# EasyEDA Pro project 2025智能物流搬运_PCB_XAUT_20250927.eprj, schematic Schematic15_1

## Sheets
1 P1: Board Name: 控制板_2.2; Create Date: 2025-07-05; Page Name: P1; Project Name: 物流车底盘测试; Schematic Name: Schematic15_1; Update Date: 2025-07-05; Company: 嘉立创EDA; Page Size: A4; Version: V1.0
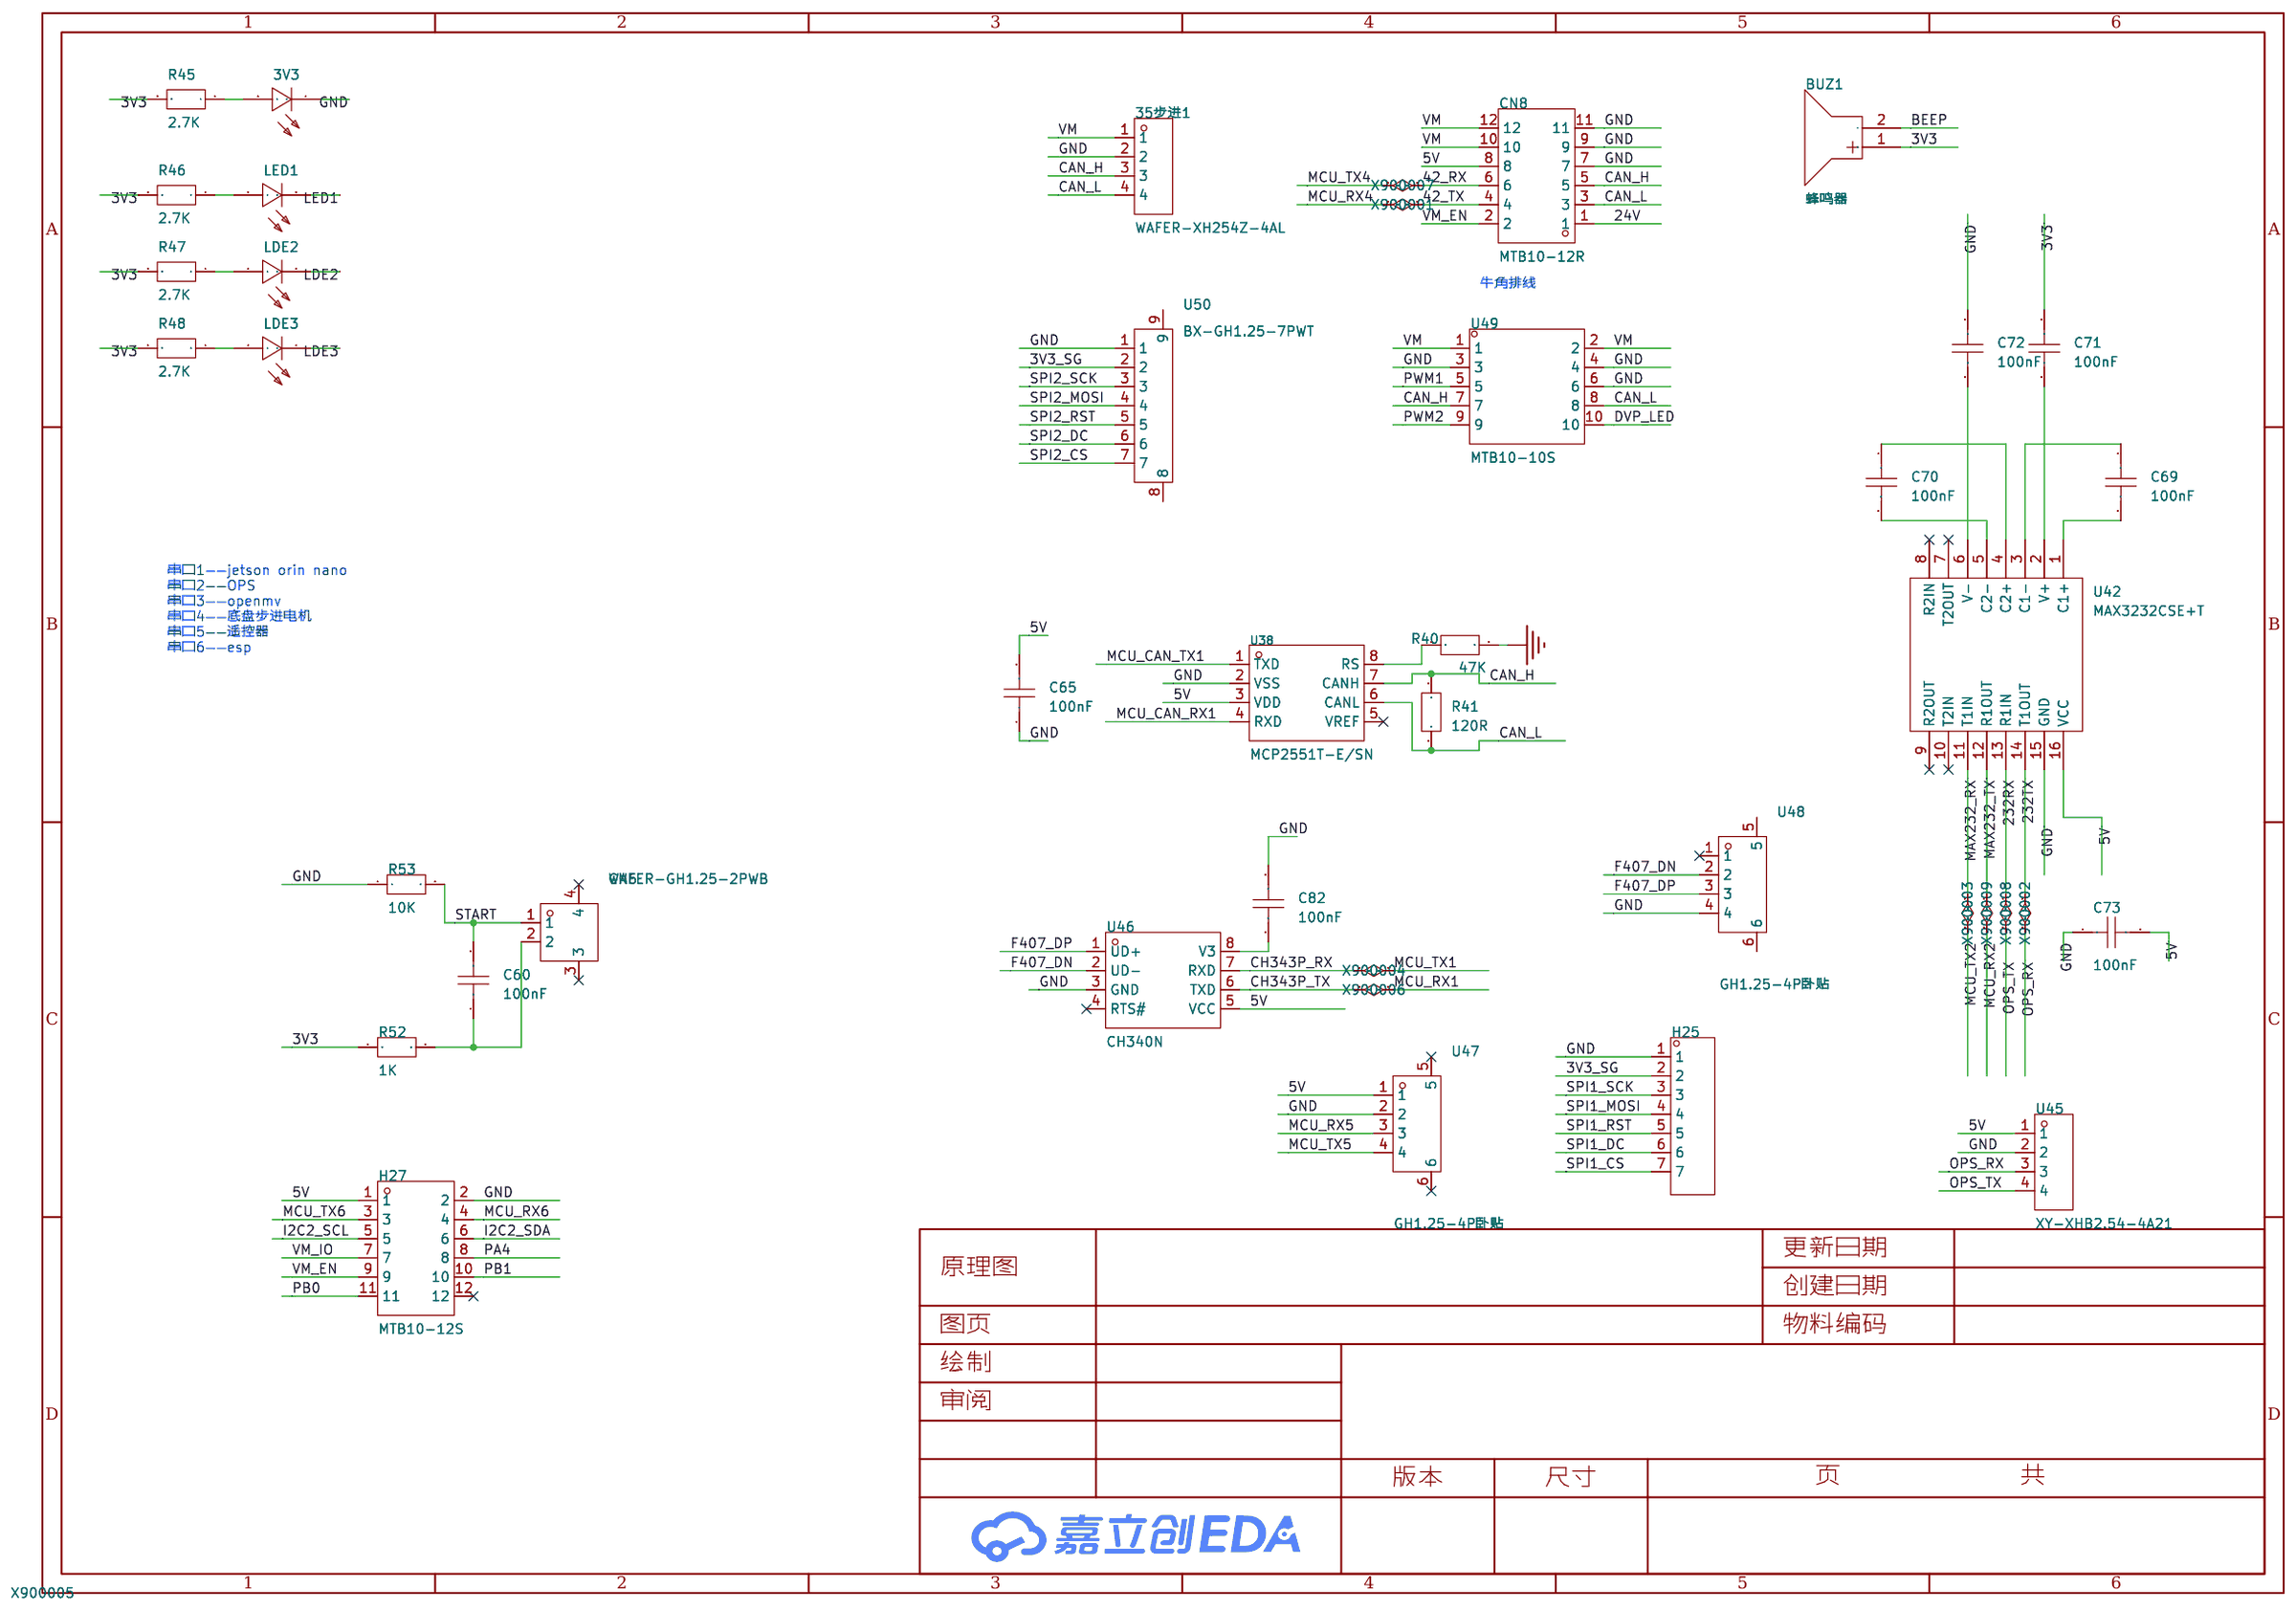
[diagram p3: P1]
2 P2: Page Name: P2
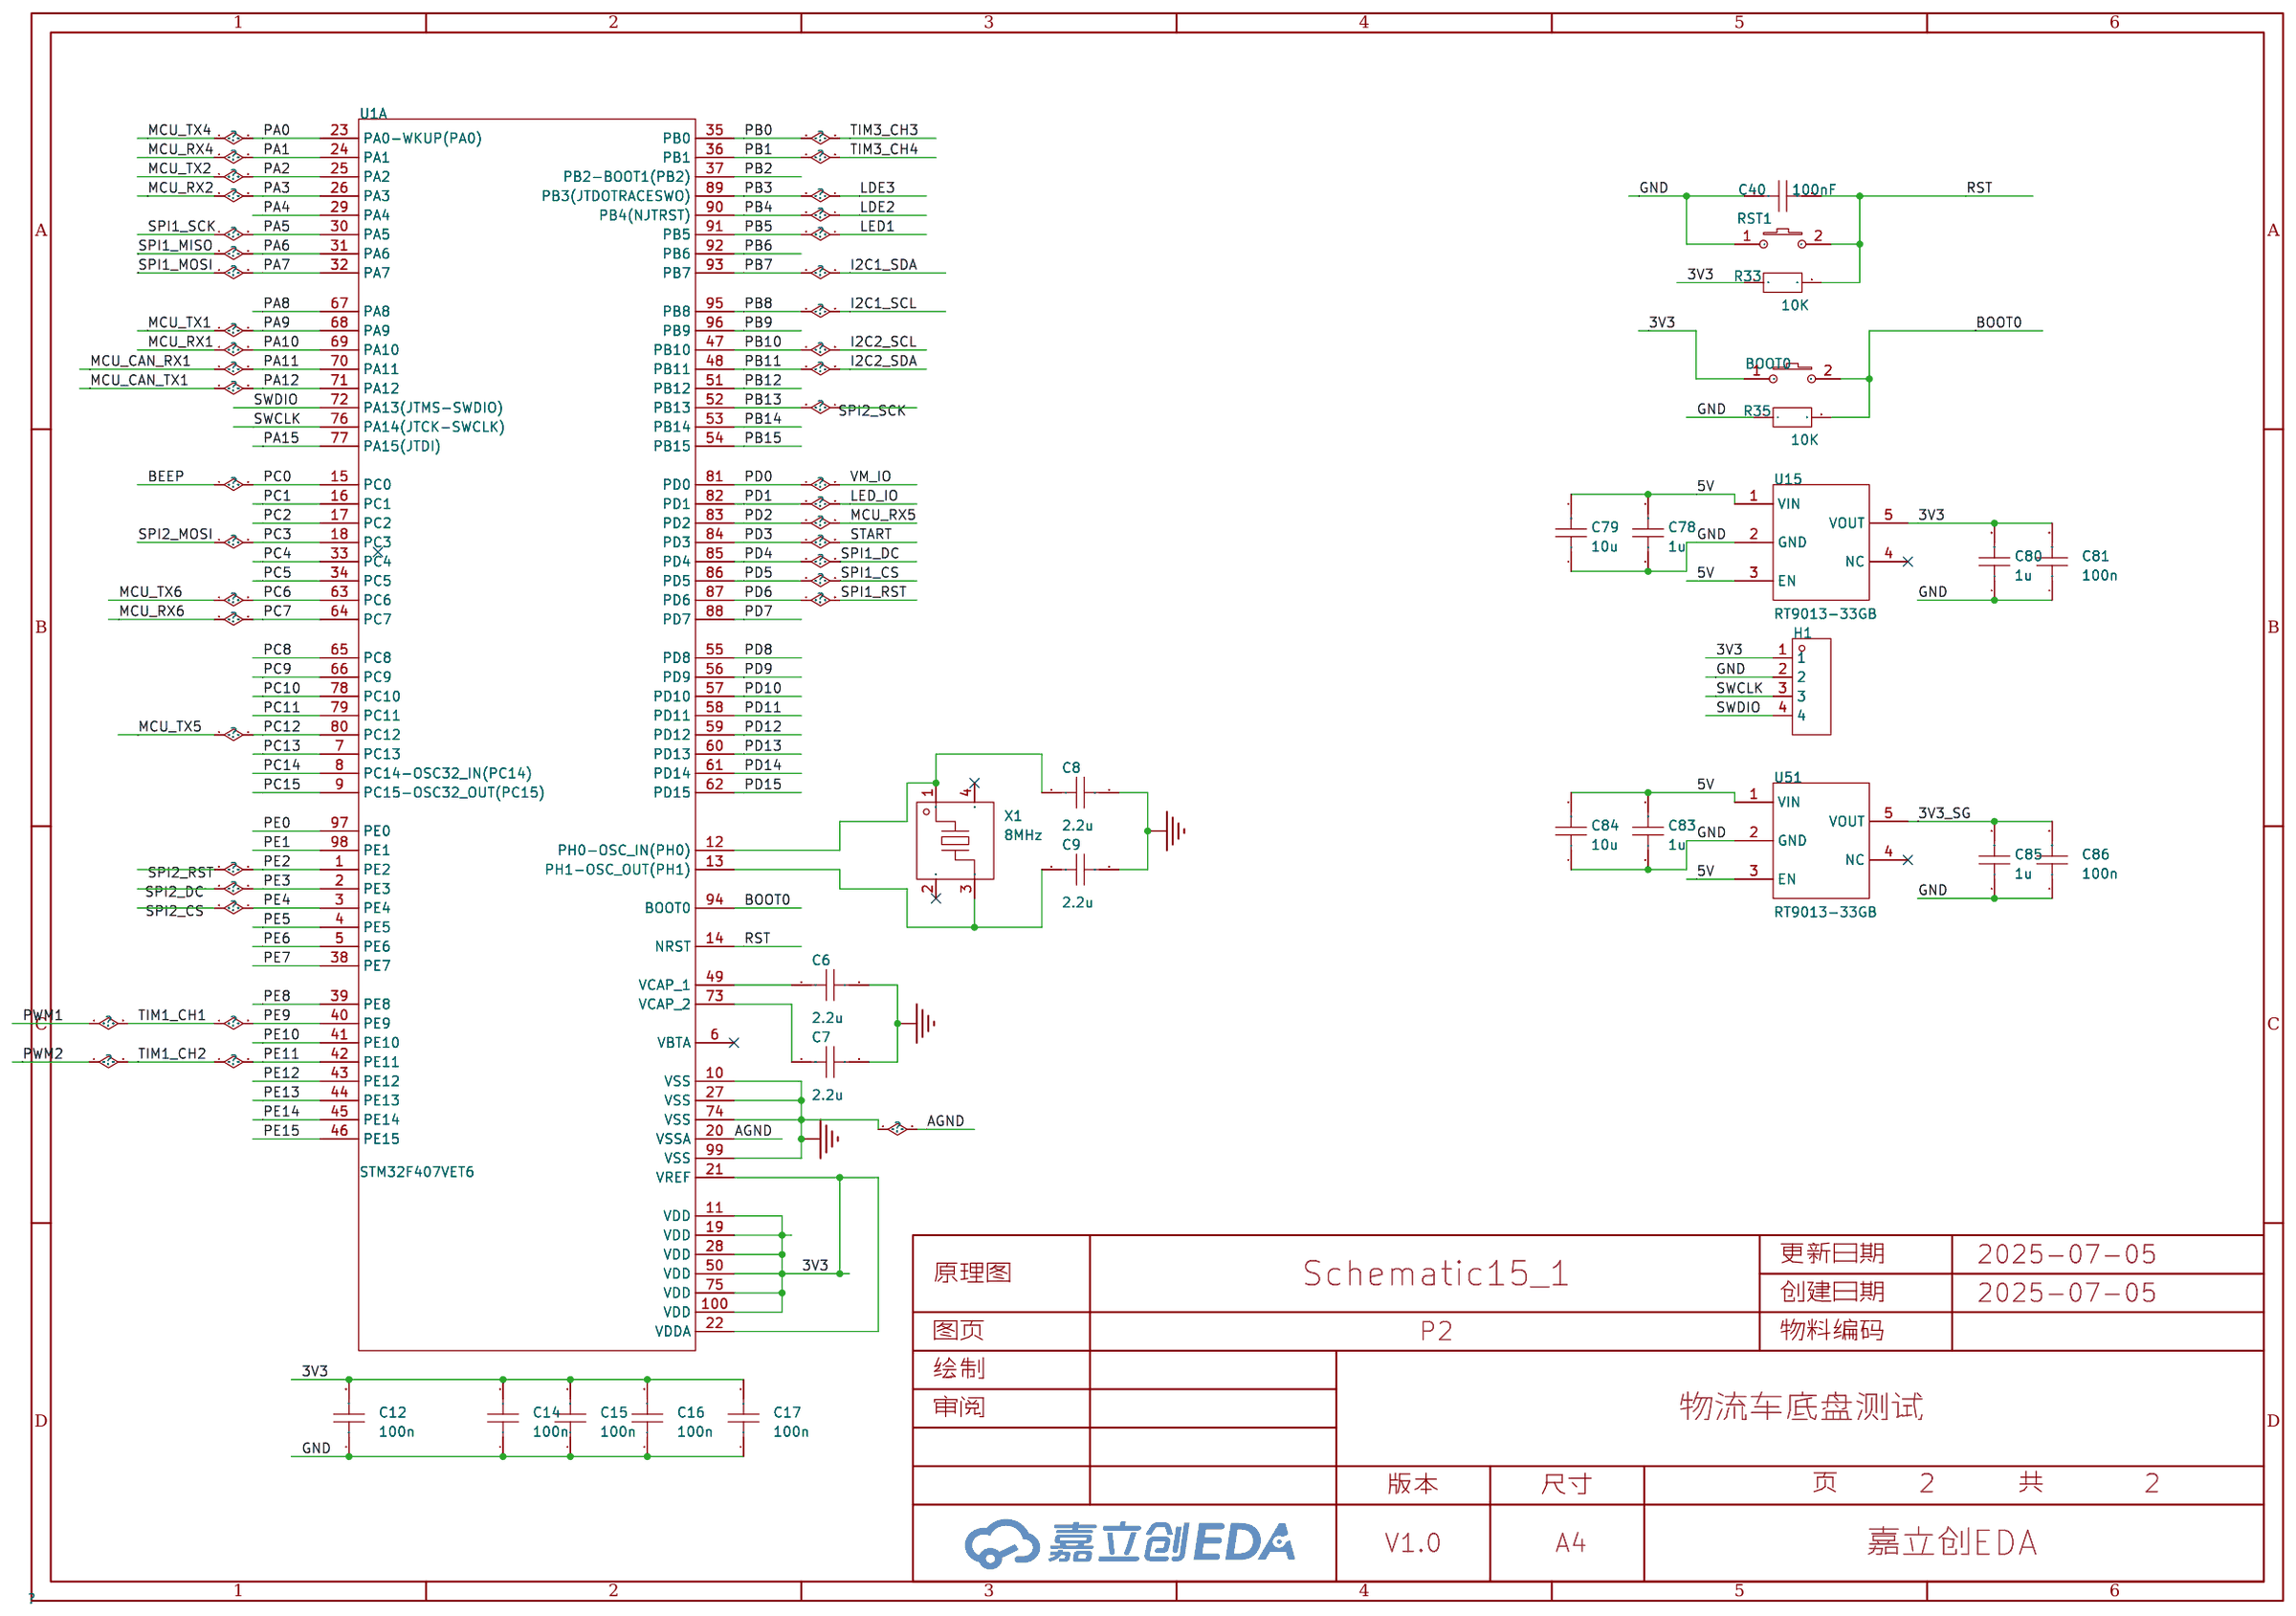
[diagram p4: P2]

## Parts
sheet P1
3V3  FC-DA1608HRK-620D  [LED0603-RD_RED]
35步进1  WAFER-XH254Z-4AL  [CONN-TH_XH2.54-4P]
BUZ1  蜂鸣器  [BUZ-TH_BD9.0-P5.00-D0.6-FD]
C60  100nF  [C0603]
C65  100nF  [C0603]
C69  100nF  [C0603]
C70  100nF  [C0603]
C71  100nF  [C0603]
C72  100nF  [C0603]
C73  100nF  [C0603]
C82  100nF  [C0603]
CN6  WAFER-GH1.25-2PWB  [CONN-TH_2P-P1.25_XUNPU_WAFER-GH1.25-2PWB]
CN8  MTB10-12R  [CONN-TH_MTB10-12R]
H25  -  [HDR-TH_7P-P2.54-V-F]
H27  MTB10-12S  [CONN-TH_12P-P2.54_MTB10-12S]
LDE2  FC-DA1608HRK-620D  [LED0603-RD_RED]
LDE3  FC-DA1608HRK-620D  [LED0603-RD_RED]
LED1  FC-DA1608HRK-620D  [LED0603-RD_RED]
R40  47K  [R0603]
R41  120R  [R0603]
R45  2.7K  [R0603]
R46  2.7K  [R0603]
R47  2.7K  [R0603]
R48  2.7K  [R0603]
R52  1K  [R0603]
R53  10K  [R0603]
U38  MCP2551T-E/SN  [SOIC-8_L4.9-W3.9-P1.27-LS6.0-BL]
U42  MAX3232CSE+T  [SOIC-16_L9.9-W3.9-P1.27-LS6.0-BL]
U45  XY-XHB2.54-4A21  [HDR-TH_4P-P2.50-H-F-W7.3-N]
U46  CH340N  [SOP-8_L4.9-W3.9-P1.27-LS6.0-BL]
U47  GH1.25-4P卧贴  [CONN-SMD_4P-P1.25_GH1.25-4P]
U48  GH1.25-4P卧贴  [CONN-SMD_4P-P1.25_GH1.25-4P]
U49  MTB10-10S  [IDC-TH_MTB110-10S]
U50  BX-GH1.25-7PWT  [CONN-SMD_7P-P1.25_BX-GH1.25-7PWT]
sheet P2
BOOT0  K2-3.6×6.1_SMD  [3*6*2.5MM轻触开关]
C6  2.2u  [C0603]
C7  2.2u  [C0603]
C8  2.2u  [C0603]
C9  2.2u  [C0603]
C12  100n  [C0603]
C14  100n  [C0603]
C15  100n  [C0603]
C16  100n  [C0603]
C17  100n  [C0603]
C40  100nF  [C0603]
C78  1u  [C0603]
C79  10u  [C0603]
C80  1u  [C0603]
C81  100n  [C0603]
C83  1u  [C0603]
C84  10u  [C0603]
C85  1u  [C0603]
C86  100n  [C0603]
H1  -  [HDR-TH_4P-P2.54-V-M]
R33  10K  [R0603]
R35  10K  [R0603]
RST1  K2-3.6×6.1_SMD  [3*6*2.5MM轻触开关]
U1  STM32F407VET6  [LQFP-100_L14.0-W14.0-P0.50-LS16.0-BL]  (section 1)
U15  RT9013-33GB  [SOT-23-5_L3.0-W1.7-P0.95-LS2.8-BL]
U51  RT9013-33GB  [SOT-23-5_L3.0-W1.7-P0.95-LS2.8-BL]
X1  8MHz  [CRYSTAL-SMD_4P-L3.2-W2.5-BL]

## Library data of the parts
3V3 LDE2 LDE3 LED1 = FC-DA1608HRK-620D: link: https://item.szlcsc.com/221679.html; Supplier: LCSC; Manufacturer: 国星光电; Manufacturer Part: NCD0603R1; Supplier Part: C84263; JLCPCB Part Class: Extended Part
35步进1 = WAFER-XH254Z-4AL: LCSC Part Name: XH直针4P 蓝色; Supplier Part: C22751797; Manufacturer: HANBO(汉博); Supplier Footprint: 插件,P=2.54mm; JLCPCB Part Class: 扩展库; Datasheet: https://atta.szlcsc.com/upload/public/pdf/source/20240628/5F265ED5DCD1AB9F6070F992FAF53820.pdf; Supplier: LCSC
BUZ1 = 蜂鸣器: Supplier Part: C9900020875; Supplier Footprint: 插件; JLCPCB Part Class: 扩展库; Supplier: LCSC
C40 C60 C65 C69-C73 C82 = 100nF: link: https://item.szlcsc.com/362304.html; 3DModel: C0603_L1.6-W0.8-H0.8
CN6 = WAFER-GH1.25-2PWB: LCSC Part Name: 1x2P 间距:1.25mm 卧贴 系列:GH; Supplier Part: C3029377; Manufacturer: XUNPU(讯普); Supplier Footprint: SMD,P=1.25mm,卧贴; Datasheet: https://atta.szlcsc.com/upload/public/pdf/source/20220527/CB8773BFB0913C3B8ABD62CB38BA101A.pdf; Supplier: LCSC; Pins Structure: 1x2P; Pitch: 1.25mm; Mounting Style: 卧贴; Reference Series: GH; Number of Pins: 2P; Number of Rows: 1; Number of PINs Per Row: 2; Current Rating (Max): 1A; Operating Temperature Range: -25℃~+85℃
CN8 = MTB10-12R: LCSC Part Name: 2.54mm 2x6P 排数:2 每排P数:6; Supplier Part: C2843204; Manufacturer: MINTRON(明硕); Supplier Footprint: 插件,P=2.54mm; JLCPCB Part Class: 扩展库; Datasheet: https://atta.szlcsc.com/upload/public/pdf/source/20210701/C2843202_CAE887C9A69CD352FC185E168B0BE83E.pdf; Supplier: LCSC; Connector Type: 简牛座; Pitch: 2.54mm; Structure: 2x6P; Current Rating (Max): 3A; Holder Type: 直插; Row Spacing: 2.54mm; Number of Rows: 2; Pin Number in each Row: 6; Operating Temperature Range: -40℃~+105℃
H25 = HDR-F_2.54_1x7P: Supplier Part: C124418; Supplier Footprint: 插件
H27 = MTB10-12S: Supplier Part: C3148238; Manufacturer: MINTRON(明硕); Supplier Footprint: 插件,P=2.54mm; Datasheet: https://atta.szlcsc.com/upload/public/pdf/source/20220705/35161231C53940228D3017974FD3B995.pdf; Supplier: LCSC; Holder Type: 直插
R33 R35 R40 R41 R45-R48 R52 R53 = 10K: 3DModel: R0603_L1.6-W0.8-H0.8; link: https://www.mouser.in/datasheet/2/447/PYu_RT_1_to_0_01_RoHS_L_11-1669912.pdf
U38 = MCP2551T-E/SN: 类型:收发器;; Supplier Part: C623210; Manufacturer: MICROCHIP(美国微芯); Supplier Footprint: SOIC-8; JLCPCB Part Class: 扩展库; Datasheet: https://atta.szlcsc.com/upload/public/pdf/source/20210609/C635953_6E475BB16B700B87E431FB7467341E18.pdf; Supplier: LCSC; Type: 收发器; Supply Voltage: 4.5V~5.5V; Operating Temperature: -40℃~+125℃
U42 = MAX3232CSE+T: 类型:收发器;驱动器/接收器:2/2;数据速率:235Kbps;; LCSC Part Name: 3.0V至5.5V 低功率 高达1Mbps 使用四个0.1μF外部电容的RS-232收发器; Supplier Part: C7258; Manufacturer: ADI(亚德诺)/MAXIM(美信); Supplier Footprint: SOIC-16; JLCPCB Part Class: 扩展库; Datasheet: https://atta.szlcsc.com/upload/public/pdf/source/20130910/1457706646424.pdf; Supplier: LCSC; Types: 收发器; Driver/receiver: 2/2; Data Rate: 235Kbps; Supply Voltage: 3V~5.5V; Operating Temperature: 0℃~+70℃
U45 = XY-XHB2.54-4A21: LCSC Part Name: 1x4P 间距:2.54mm 弯插; Supplier Part: C19271397; Manufacturer: XYECONN(辛译); Supplier Footprint: 弯插,P=2.54mm; Datasheet: https://atta.szlcsc.com/upload/public/pdf/source/20231124/E581531705911B495C6E735B7C4EA3F8.pdf; Supplier: LCSC; Pins Structure: 1x4P; Pitch: 2.54mm; Mounting Style: 弯插; Number of Pins: 4P; Number of Rows: 1; Number of PINs Per Row: 4; Row Spacing: 2.54mm; Current Rating (Max): 2A; Operating Temperature Range: -25℃~+85℃
U46 = CH340N: LCSC Part Name: USB转串口芯片CH340; Supplier Part: C2977777; Manufacturer: WCH(南京沁恒); Supplier Footprint: SOP-8; JLCPCB Part Class: 扩展库; Datasheet: https://atta.szlcsc.com/upload/public/pdf/source/20240313/115CDE92081B1D6CB446704AD5D0F5F2.pdf; Supplier: LCSC; Applications Function: USB转串口; Protocol: USB 2.0; Number of Channels: 1; Supply Voltage: 3.3V；5V; Data Rate: 2Mbps; Operating Temperature: -20℃~+70℃
U47 U48 = GH1.25-4P卧贴: Supplier Part: C9900014670; JLCPCB Part Class: 扩展库; Supplier: LCSC
U49 = MTB10-10S: LCSC Part Name: 2.54mm 2x5P 排数:2 每排P数:5; Supplier Part: C358743; Manufacturer: MINTRON(明硕); Supplier Footprint: 插件,P=2.54mm; JLCPCB Part Class: 扩展库; Datasheet: https://atta.szlcsc.com/upload/public/pdf/source/20190124/C358750_E3578BC2367A1528391A7216FECD5344.pdf; Supplier: LCSC; Connector Type: 简牛座; Pitch: 2.54mm; Structure: 2x5P; Holder Type: 直插; Row Spacing: 2.54mm; Number of Rows: 2; Pin Number in each Row: 5; Contact Material: 黄铜
U50 = BX-GH1.25-7PWT: LCSC Part Name: 1x7P 间距:1.25mm 卧贴 系列:GH; Supplier Part: C18077723; Manufacturer: Bossie(博锡); Supplier Footprint: SMD,P=1.25mm,卧贴; JLCPCB Part Class: 扩展库; Datasheet: https://atta.szlcsc.com/upload/public/pdf/source/20231017/E21872F9B85DEECEBF976C7E4F518E45.pdf; Supplier: LCSC; Pins Structure: 1x7P; Pitch: 1.25mm; Mounting Type: 卧贴; Reference Series: GH; Number of Pins: 7P; Number of Rows: 1; Number of PINs Per Row: 7; Current Rating: 1A; Contact Material: 磷铜; Contact Plating: 锡; Operating Temperature: -25℃~+85℃; Voltage Rating: 125V; Plastic Material: LCP; Supplementary Features: 辅助焊脚; Color: 米色; Z-Height of the Board: 4.35mm; X-Length of Bottom Edge on Board (Spacing Line): 12mm; Y-Width of Bottom Edge on Board: 5mm
BOOT0 RST1 = K2-3.6×6.1_SMD: Supplier Part: C118141; Supplier: LCSC; Manufacturer Part: K2-1107ST-A4SW-06; 制造商: 韩国韩荣
C6-C9 C12 C14-C17 C78-C81 C83-C86 = CL10A106KP8NNNC: 容值:10uF;精度:±10%;额定电压:10V;材质(温度系数):X5R;; LCSC Part Name: 10uF ±10% 10V; Supplier Part: C19702; Manufacturer: SAMSUNG(三星); Supplier Footprint: 0603; JLCPCB Part Class: 基础库; Datasheet: https://atta.szlcsc.com/upload/public/pdf/source/20160218/1457707763339.pdf; Supplier: LCSC; Tolerance: ±10%; Voltage Rated: 10V; Temperature Coefficient: X5R
H1 = HDR-M_2.54_1x4P: Supplier Part: C492403; Supplier Footprint: 插件
U1 = STM32F407VET6: CPU内核:ARM-M4;程序存储容量:512KB;RAM总容量:192KB;GPIO端口数量:82;工作电压范围:1.8V~3.6V;CPU最大主频:168MHz;程序存储器类型:FLASH;; LCSC Part Name: 带DSP和FPU的高性能基础系列ARM Cortex-M4 MCU，具有512 KB Flash、168 MHz CPU、ART加速器、以太网和FSMC; Supplier Part: C28730; Manufacturer: ST(意法半导体); Supplier Footprint: LQFP-100(14x14); JLCPCB Part Class: 扩展库; Datasheet: https://atta.szlcsc.com/upload/public/pdf/source/20140801/1457707197138.pdf; Supplier: LCSC; CPU Core: ARM-M4; Program Storage Size: 512KB; RAM Size: 192KB; GPIO Ports Number: 82; Operating Voltage Range: 1.8V~3.6V; CPU Maximum Speed: 168MHz; Program Memory Type: FLASH; Operating Temperature Range: -40℃~+85℃; ADC (Bit): 12bit; DAC (Bit): 12bit; Universal Serial Bus: 有; Peripheral/Function: DMA；LCD/LED驱动；PWM; Watchdog: 有; Infrared Data Association: 有; Low-Voltage Detect: 有; LCD Module: 有; Direct Memory Access: 有; Internal Oscillator: 有
U15 U51 = RT9013-33GB: 输出类型:固定;最大输入电压:5.5V;输出电压:3.3V;最大输出电流:500mA;电源纹波抑制比(PSRR):50dB@(10kHz);输出极性:正极;; LCSC Part Name: 输入5.5V 输出3.3V 500mA; Supplier Part: C47773; Manufacturer: RICHTEK(立锜); Supplier Footprint: SOT-23-5; Datasheet: https://atta.szlcsc.com/upload/public/pdf/source/20150504/1457707282459.pdf; Supplier: LCSC; Output Type: 固定; Maximum Input Voltage: 5.5V; Output Voltage: 3.3V; MAX Output Current: 500mA; Power Supply Rejection Ratio (PSRR): 50dB@(10kHz); Dropout Voltage: 400mV@(500mA); standby current: 50uA; Operating Temperature: -40℃~+85℃; Output Polarity: 正极; Number of Outputs: 1
X1 = 3225 8M 12PF 10PPM: 频率:8MHz;常温频差:±10ppm;外接负载电容:12pF;频率稳定度(全温):±30ppm;; LCSC Part Name: 8MHz ±10ppm 12pF; Supplier Part: C5181478; Manufacturer: SST(索斯特); Supplier Footprint: SMD3225-4P; Datasheet: https://atta.szlcsc.com/upload/public/pdf/source/20220927/1326F2655F4EFAC0B3F2FF2C267EC937.pdf; Supplier: LCSC; Normal temperature Frequency Tolerance: ±10ppm; External load capacitor: 12pF; Frequency Stability(Full temperature range): ±30ppm; Operating Temperature: -20℃~+70℃

## Nets
3V3: BOOT0.1 BUZ1.1(+) C12.2 C14.2 C15.2 C16.2 C17.2 C71.1 C80.2 C81.2 H1.1 R33.1 R45.2 R46.2 R47.2 R48.2 R52.2 U1.11(VDD) U1.19(VDD) U1.21(VREF) U1.22(VDDA) U1.28(VDD) U1.50(VDD) U1.75(VDD) U1.100(VDD) U15.5(VOUT)
3V3_SG: C85.2 C86.2 H25.2 U50.2 U51.5(VOUT)
5V: C65.2 C73.2 C78.2 C79.2 C83.2 C84.2 CN8.8 H27.1 U15.1(VIN) U15.3(EN) U38.3(VDD) U42.16(VCC) U45.1 U46.5(VCC) U47.1 U51.1(VIN) U51.3(EN)
24V: CN8.1
GND: 3V3.1(K) 35步进1.2 C6.2 C7.2 C8.2 C9.2 C12.1 C14.1 C15.1 C16.1 C17.1 C40.1 C65.1 C72.1 C73.1 C78.1 C79.1 C80.1 C81.1 C82.2 C83.1 C84.1 C85.1 C86.1 CN8.7 CN8.9 CN8.11 H1.2 H25.1 H27.2 R35.1 R40.2 R53.1 RST1.1 U1.10(VSS) U1.20(VSSA) U1.27(VSS) U1.74(VSS) U1.99(VSS) U15.2(GND) U38.2(VSS) U42.15(GND) U45.2 U46.3(GND) U47.2 U48.4 U49.3 U49.4 U49.6 U50.1 U51.2(GND)
42_RX: CN8.6 U1.23(PA0-WKUP(PA0))
42_TX: CN8.4 U1.24(PA1)
232RX: U42.13(R1IN) U45.4
232TX: U42.14(T1OUT) U45.3
BEEP: BUZ1.2(-) U1.15(PC0)
BOOT0: BOOT0.2 R35.2 U1.94(BOOT0)
CAN_H: 35步进1.3 CN8.5 R41.2 U38.7(CANH) U49.7
CAN_L: 35步进1.4 CN8.3 R41.1 U38.6(CANL) U49.8
CH343P_RX: U1.68(PA9) U46.7(RXD)
CH343P_TX: U1.69(PA10) U46.6(TXD)
DVP_LED: U49.10
F407_DN: U46.2(UD-) U48.2
F407_DP: U46.1(UD+) U48.3
I2C1_SCL: U1.95(PB8)
I2C1_SDA: U1.93(PB7)
I2C2_SCL: H27.5 U1.47(PB10)
I2C2_SDA: H27.6 U1.48(PB11)
LDE2: LDE2.1(K) U1.90(PB4(NJTRST))
LDE3: LDE3.1(K) U1.89(PB3(JTDOTRACESWO))
LED1: LED1.1(K) U1.91(PB5)
LED_IO: U1.82(PD1)
MAX232_RX: U1.25(PA2) U42.11(T1IN)
MAX232_TX: U1.26(PA3) U42.12(R1OUT)
MCU_CAN_RX1: U1.70(PA11) U38.4(RXD)
MCU_CAN_TX1: U1.71(PA12) U38.1(TXD)
MCU_RX5: U1.83(PD2) U47.3
MCU_RX6: H27.4 U1.64(PC7)
MCU_TX5: U1.80(PC12) U47.4
MCU_TX6: H27.3 U1.63(PC6)
PA4: H27.8 U1.29(PA4)
PA5: H25.3 U1.30(PA5)
PA6: U1.31(PA6)
PA7: H25.4 U1.32(PA7)
PA8: U1.67(PA8)
PA15: U1.77(PA15(JTDI))
PB0: H27.11 U1.35(PB0)
PB1: H27.10 U1.36(PB1)
PB2: U1.37(PB2-BOOT1(PB2))
PB6: U1.92(PB6)
PB9: U1.96(PB9)
PB12: U1.51(PB12)
PB13: U1.52(PB13) U50.3
PB14: U1.53(PB14)
PB15: U1.54(PB15)
PC1: U1.16(PC1)
PC2: U1.17(PC2)
PC3: U1.18(PC3) U50.4
PC4: U1.33(PC4)
PC5: U1.34(PC5)
PC8: U1.65(PC8)
PC9: U1.66(PC9)
PC10: U1.78(PC10)
PC11: U1.79(PC11)
PC13: U1.7(PC13)
PC14: U1.8(PC14-OSC32_IN(PC14))
PC15: U1.9(PC15-OSC32_OUT(PC15))
PD0: H27.7 U1.81(PD0)
PD3: C60.2 CN6.1 R53.2 U1.84(PD3)
PD4: H25.6 U1.85(PD4)
PD5: H25.7 U1.86(PD5)
PD6: H25.5 U1.87(PD6)
PD7: U1.88(PD7)
PD8: U1.55(PD8)
PD9: U1.56(PD9)
PD10: U1.57(PD10)
PD11: U1.58(PD11)
PD12: U1.59(PD12)
PD13: U1.60(PD13)
PD14: U1.61(PD14)
PD15: U1.62(PD15)
PE0: U1.97(PE0)
PE1: U1.98(PE1)
PE2: U1.1(PE2) U50.5
PE3: U1.2(PE3) U50.6
PE4: U1.3(PE4) U50.7
PE5: U1.4(PE5)
PE6: U1.5(PE6)
PE7: U1.38(PE7)
PE8: U1.39(PE8)
PE9: U1.40(PE9) U49.5
PE10: U1.41(PE10)
PE11: U1.42(PE11) U49.9
PE12: U1.43(PE12)
PE13: U1.44(PE13)
PE14: U1.45(PE14)
PE15: U1.46(PE15)
RST: C40.2 R33.2 RST1.2 U1.14(NRST)
SWCLK: H1.3 U1.76(PA14(JTCK-SWCLK))
SWDIO: H1.4 U1.72(PA13(JTMS-SWDIO))
VM: 35步进1.1 CN8.10 CN8.12 U49.1 U49.2
VM_EN: CN8.2 H27.9
$1N1823: LDE3.2(A) R48.1
$1N1826: LDE2.2(A) R47.1
$1N1841: LED1.2(A) R46.1
$1N1844: 3V3.2(A) R45.1
$1N1877: C70.2 U42.5(C2-)
$1N1878: C69.1 U42.3(C1-)
$1N1879: C69.2 U42.1(C1+)
$1N1880: C72.2 U42.6(V-)
$1N1881: C71.2 U42.2(V+)
$1N1882: C70.1 U42.4(C2+)
$1N2061: C82.1 U46.8(V3)
$1N2064: R40.1 U38.8(RS)
$1N4644: C60.1 CN6.2 R52.1
$2N1642: C8.1 U1.12(PH0-OSC_IN(PH0)) X1.1
$2N1643: C9.1 U1.13(PH1-OSC_OUT(PH1)) X1.3
$2N1753: C7.1 U1.73(VCAP_2)
$2N1754: C6.1 U1.49(VCAP_1)

Not connected (* = marked no-connect by the designer): CN6 3* 4*; H27 12*; U1 6(VBTA)*; U15 4(NC)*; U38 5(VREF)*; U42 7(T2OUT)* 8(R2IN)* 9(R2OUT)* 10(T2IN)*; U46 4(RTS#)*; U47 5* 6*; U48 1* 5 6; U50 8 9; U51 4(NC)*; X1 2(GND)* 4(GND)*

## Notes on the sheets
sheet 1
- 牛角排线
- 串口1——jetson orin nano
  串口2——OPS
  串口3——openmv
  串口4——底盘步进电机
  串口5——遥控器
  串口6——esp
